# Altium schematic sheet System.SchDoc
size 304 x 203 mm; SheetNumber: 0; SheetTotal: 0
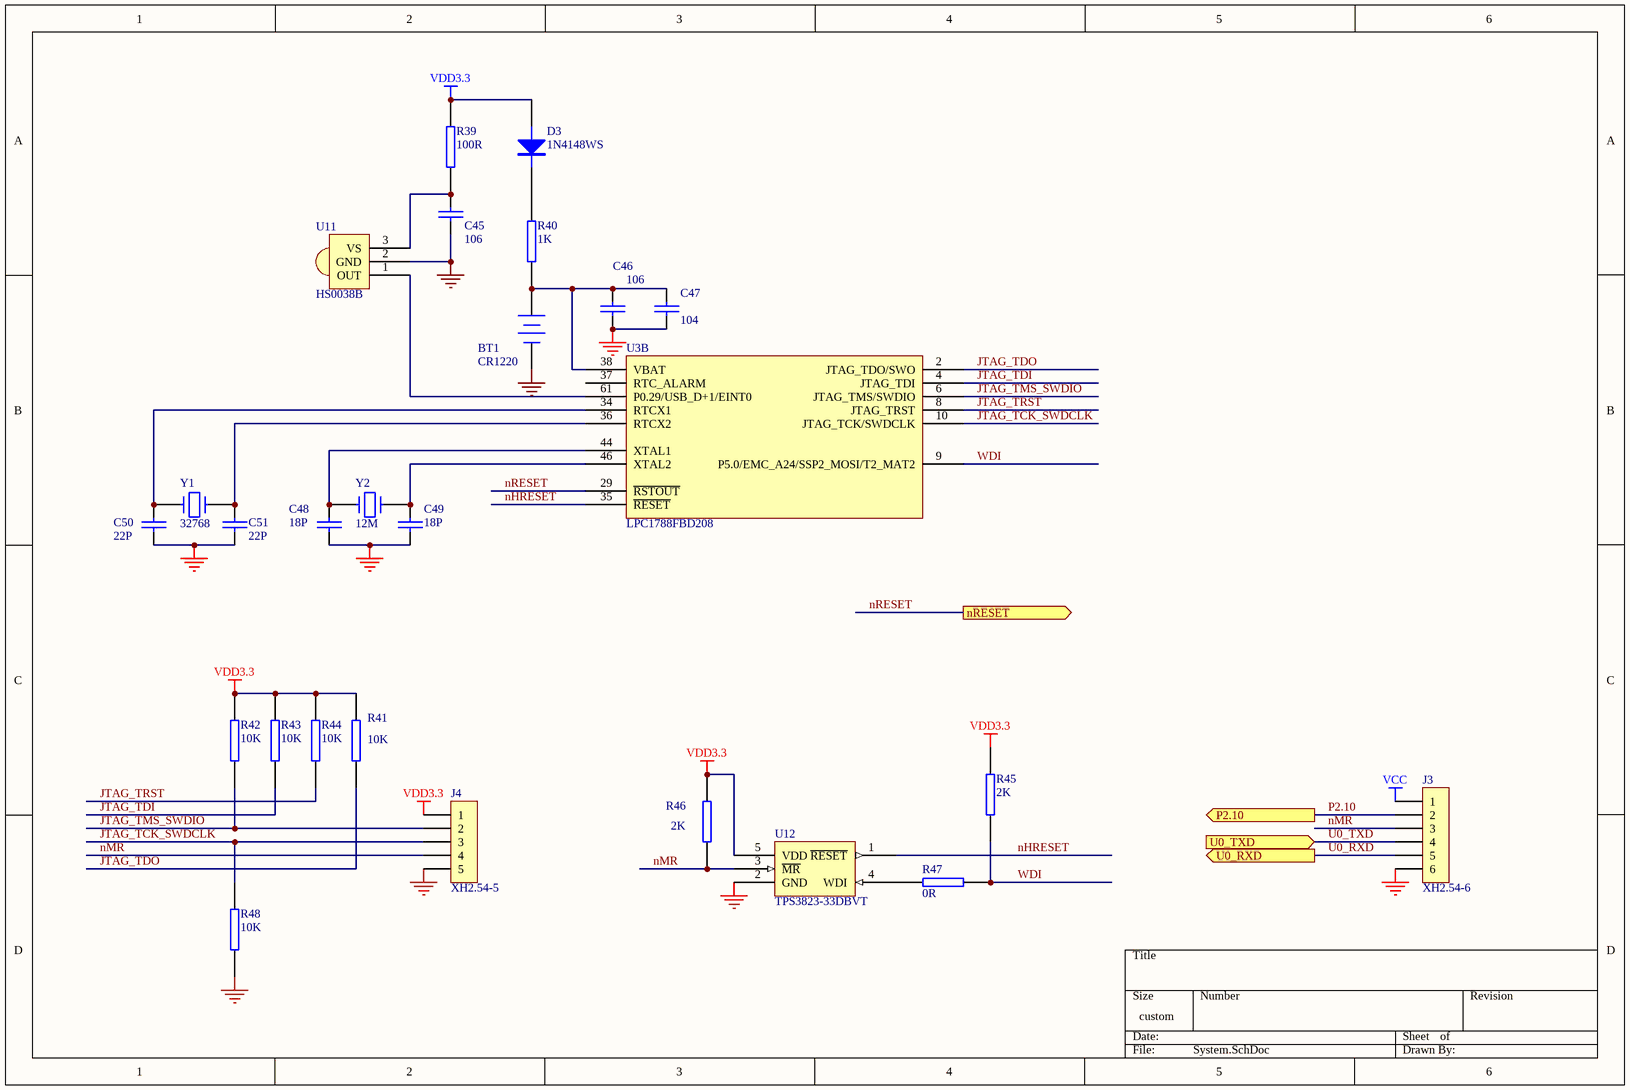
[diagram p0: System.SchDoc]

## Parts
BT1  CR1220  [CR1220]
C45  106  [C0603]
C46  106  [C0603]
C47  104  [C0603]
C48  18P  [C0603]
C49  18P  [C0603]
C50  22P  [C0603]
C51  22P  [C0603]
D3  1N4148WS  [SOD323]
J3  XH2.54-6  [A2501WF-06A]
J4  XH2.54-5  [A2501WF-05A]
R39  100R  [R0603]
R40  1K  [R0603]
R41  10K  [R0603]
R42  10K  [R0603]
R43  10K  [R0603]
R44  10K  [R0603]
R45  2K  [R0603]
R46  2K  [R0603]
R47  0R  [R0603]
R48  10K  [R0603]
U3  LPC1788FBD208  [QFP208]  (part B of 8)
U11  HS0038B  [HS0038B]
U12  TPS3823-33DBVT  [TSOP-5]
Y1  32768  [MC-306]
Y2  12M  [CY5032]

## Ports
nRESET (out), P2.10 (out), U0_RXD (out), U0_TXD (in)

## Nets
GND: BT1.2(-) C45.2 C46.2 C47.2 C48.2 C49.2 C50.2 C51.2 J3.6 J4.5 R48.1 U11.2(GND) U12.2(GND)
VCC: J3.1
VDD3.3: D3.1(A) J4.1 R39.2 R41.2 R42.2 R43.2 R44.2 R45.2 R46.2 U12.5(VDD)
JTAG_TCK_SWDCLK: J4.3 R48.2 U3.10(JTAG_TCK/SWDCLK)
JTAG_TDI: R43.1 U3.4(JTAG_TDI)
JTAG_TDO: R41.1 U3.2(JTAG_TDO/SWO)
JTAG_TMS_SWDIO: J4.2 R42.1 U3.6(JTAG_TMS/SWDIO)
JTAG_TRST: R44.1 U3.8(JTAG_TRST)
nHRESET: U3.35(~{RESET}) U12.1(~{RESET})
nMR: J3.3 J4.4 R46.1 U12.3(~{MR})
nRESET: U3.29(~{RSTOUT}) ; port nRESET
P2.10: J3.2 ; port P2.10
U0_RXD: J3.5 ; port U0_RXD
U0_TXD: J3.4 ; port U0_TXD
WDI: R45.1 R47.2 U3.9(P5.0/EMC_A24/SSP2_MOSI/T2_MAT2)
NetBT1_1: BT1.1(+) C46.1 C47.1 R40.2 U3.38(VBAT)
NetC45_1: C45.1 R39.1 U11.3(VS)
NetC48_1: C48.1 U3.44(XTAL1) Y2.1
NetC49_1: C49.1 U3.46(XTAL2) Y2.2
NetC50_1: C50.1 U3.34(RTCX1) Y1.2
NetC51_1: C51.1 U3.36(RTCX2) Y1.1
NetD3_2: D3.2(K) R40.1
NetR47_1: R47.1 U12.4(WDI)
NetU3_61: U3.61(P0.29/USB_D+1/EINT0) U11.1(OUT)

Not connected (* = marked no-connect by the designer): U3 37(RTC_ALARM)

## Library data of the parts
BT1 = Battery: Multicell Battery; Published: 24-Mar-1999; LatestRevisionDate: 17-Jul-2002; LatestRevisionNote: Re-released for DXP Platform.; PackageReference: BAT-2; Publisher: Altium Limited
C45-C51 = CAP: Capacitor
D3 = DIODE
J3 = XH2.54-6-SMD
J4 = XH2.54-5-SMD
R39-R48 = RES2
Y1 Y2 = CRYSTAL